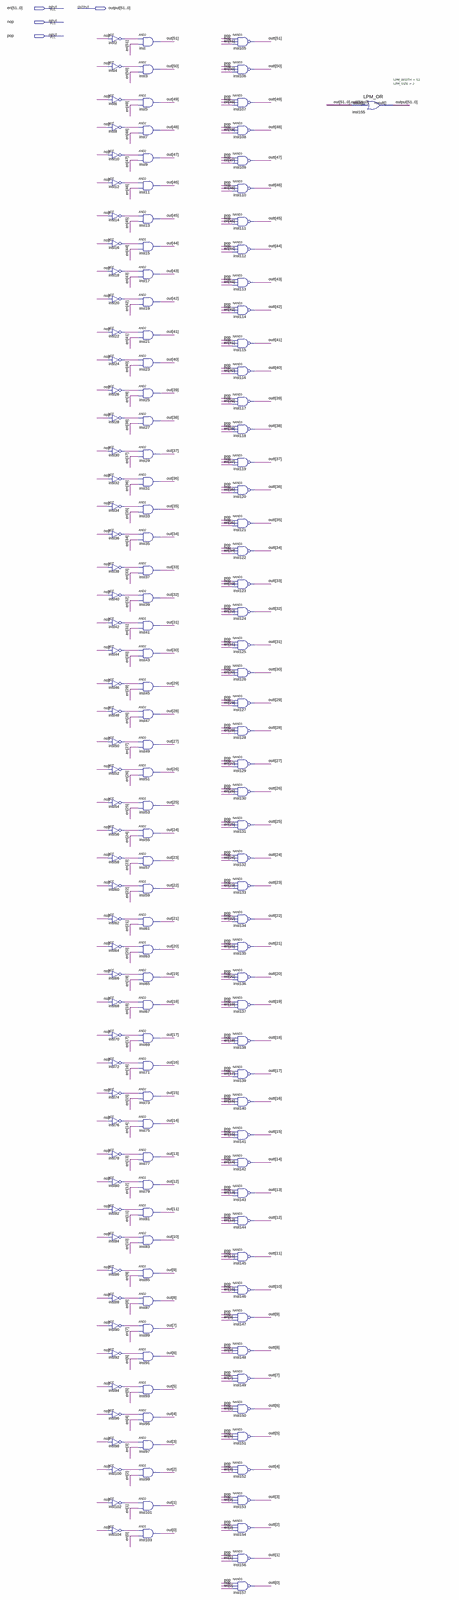
[diagram p0: schematic sheet, whole]
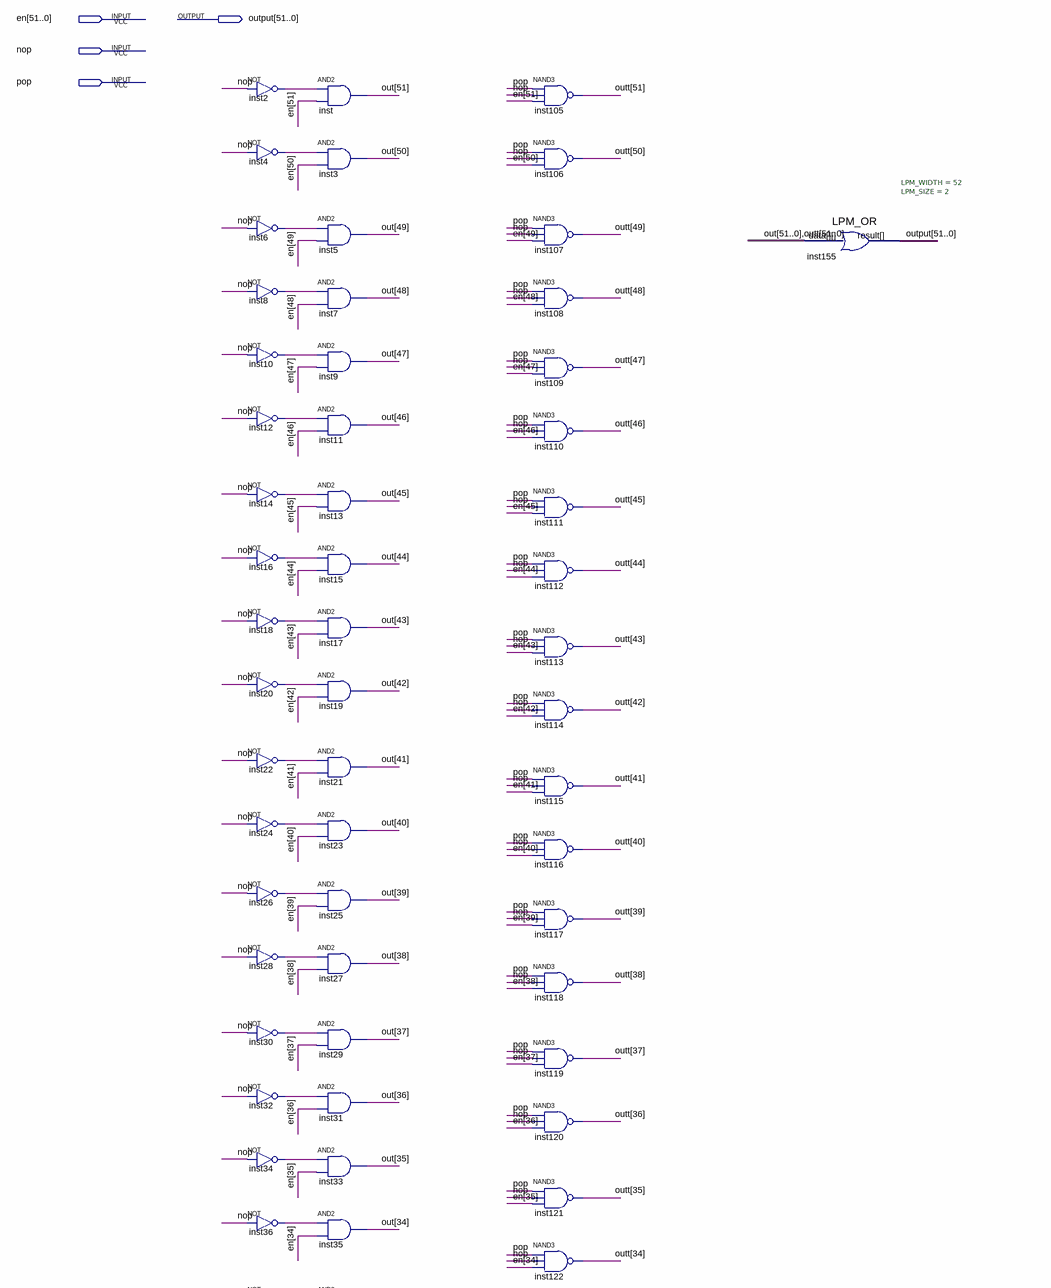
[diagram p1: schematic sheet, upper part]
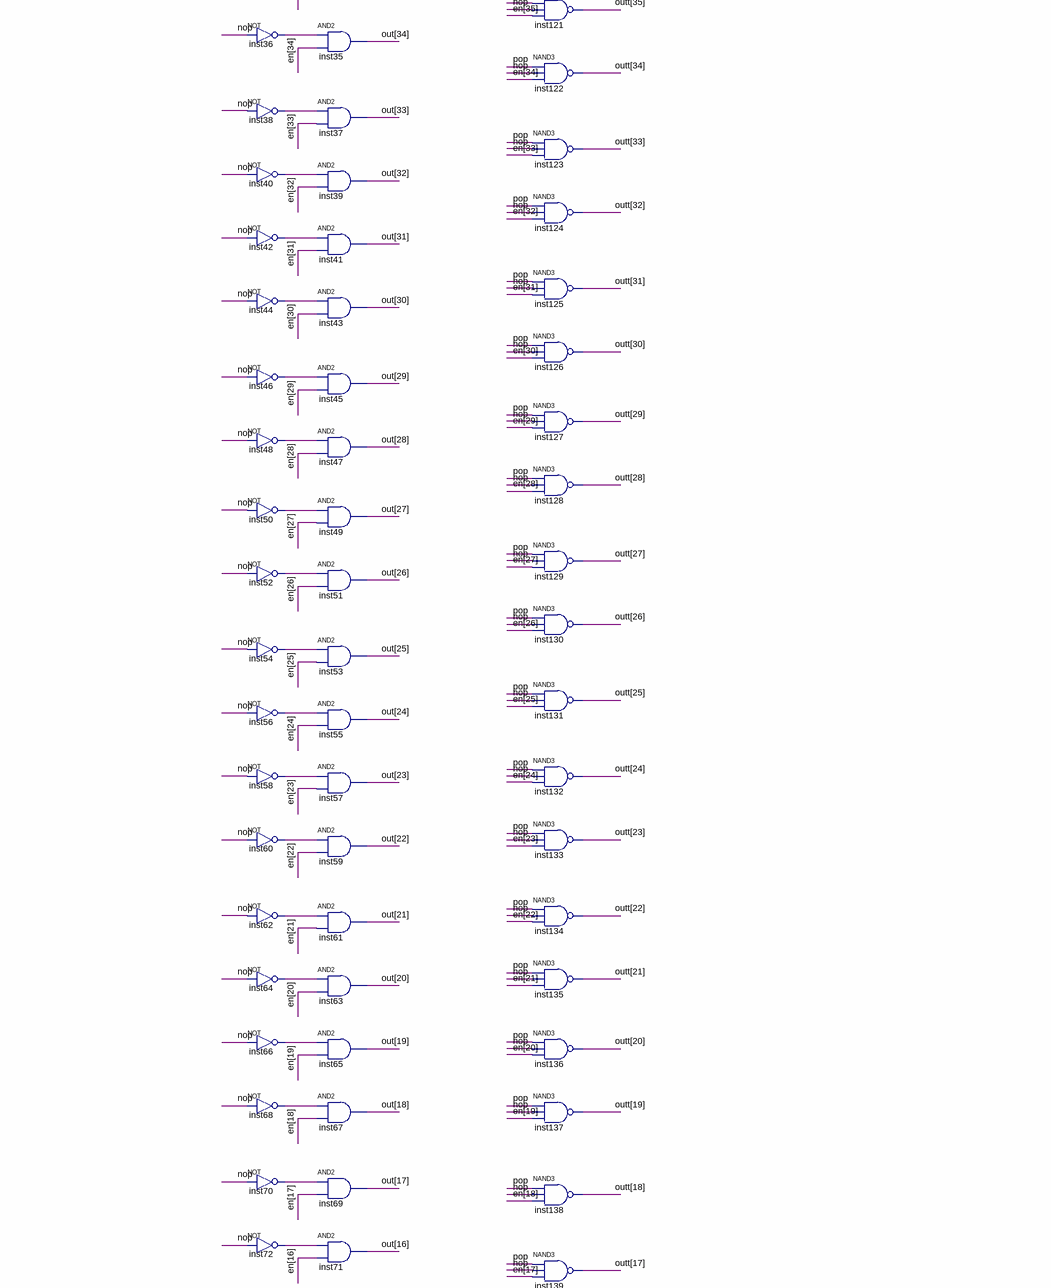
[diagram p2: schematic sheet, middle part]
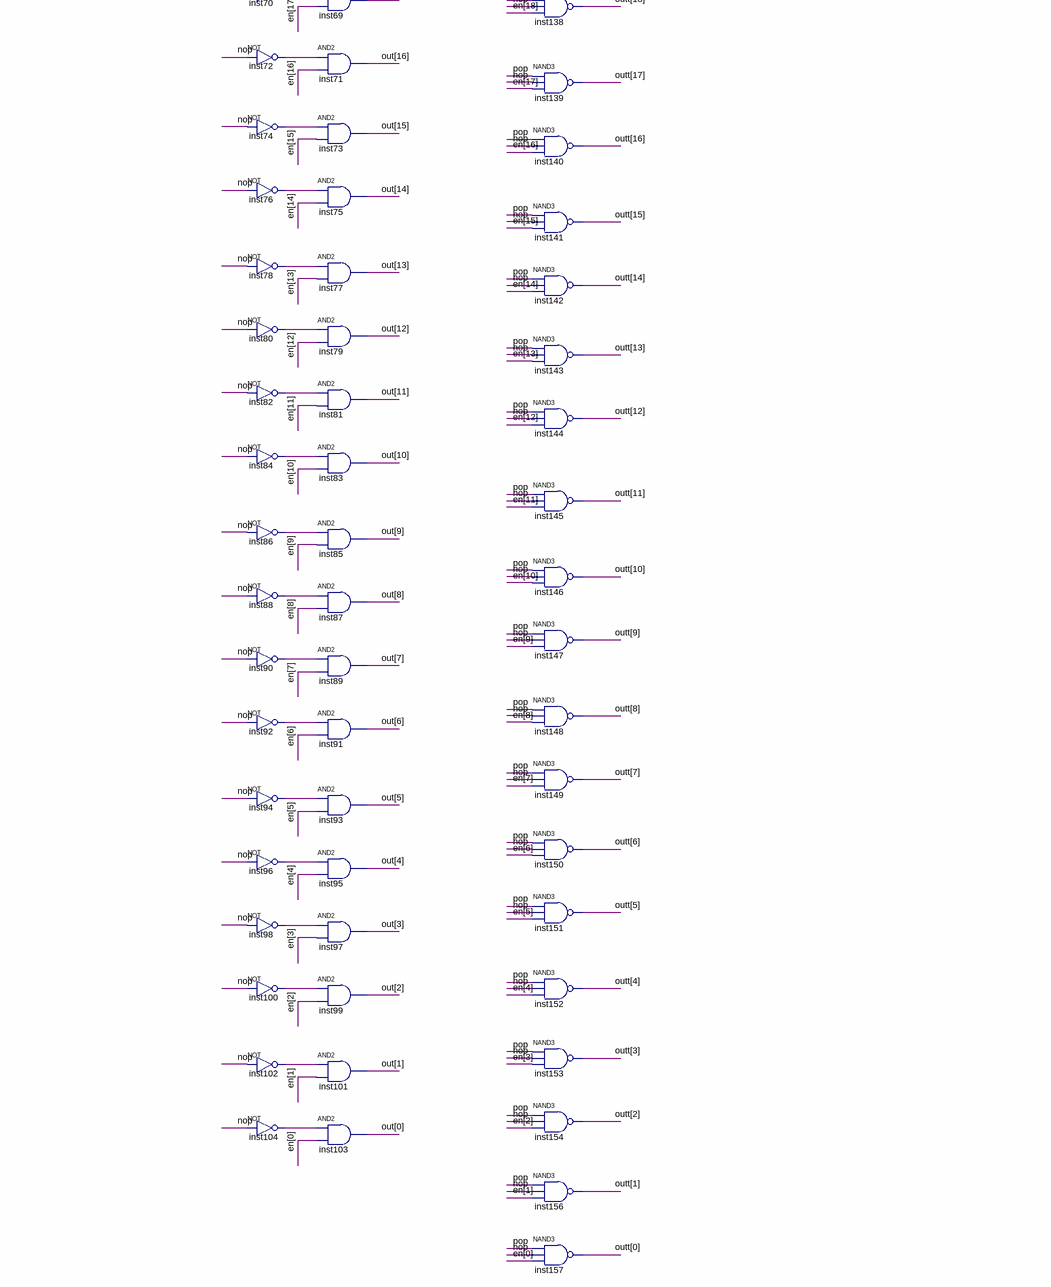
[diagram p3: schematic sheet, lower part]
// Quartus schematic nop_pop_circuit.bdf as structural Verilog: 157 symbols, 4 pins
module nop_pop_circuit (
  input  [51:0] en,
  input  nop,
  input  pop,
  output [51:0] \output 
);

  wire inst2_out, inst4_out, inst6_out, inst8_out, inst10_out, inst12_out, inst14_out, inst16_out,
       inst18_out, inst20_out, inst22_out, inst24_out, inst26_out, inst28_out, inst30_out, inst32_out,
       inst34_out, inst36_out, inst38_out, inst40_out, inst42_out, inst44_out, inst46_out, inst48_out,
       inst50_out, inst52_out, inst54_out, inst56_out, inst58_out, inst60_out, inst62_out, inst64_out,
       inst66_out, inst68_out, inst70_out, inst72_out, inst74_out, inst76_out, inst78_out, inst80_out,
       inst82_out, inst84_out, inst86_out, inst88_out, inst90_out, inst92_out, inst94_out, inst96_out,
       inst98_out, inst100_out, inst102_out, inst104_out;
  wire [51:0] out, outt;

  not inst2 (inst2_out, nop);
  not inst4 (inst4_out, nop);
  not inst6 (inst6_out, nop);
  not inst8 (inst8_out, nop);
  not inst10 (inst10_out, nop);
  not inst12 (inst12_out, nop);
  not inst14 (inst14_out, nop);
  not inst16 (inst16_out, nop);
  not inst18 (inst18_out, nop);
  not inst20 (inst20_out, nop);
  not inst22 (inst22_out, nop);
  not inst24 (inst24_out, nop);
  not inst26 (inst26_out, nop);
  not inst28 (inst28_out, nop);
  not inst30 (inst30_out, nop);
  not inst32 (inst32_out, nop);
  not inst34 (inst34_out, nop);
  not inst36 (inst36_out, nop);
  not inst38 (inst38_out, nop);
  not inst40 (inst40_out, nop);
  not inst42 (inst42_out, nop);
  not inst44 (inst44_out, nop);
  not inst46 (inst46_out, nop);
  not inst48 (inst48_out, nop);
  not inst50 (inst50_out, nop);
  not inst52 (inst52_out, nop);
  not inst54 (inst54_out, nop);
  not inst56 (inst56_out, nop);
  not inst58 (inst58_out, nop);
  not inst60 (inst60_out, nop);
  not inst62 (inst62_out, nop);
  not inst64 (inst64_out, nop);
  not inst66 (inst66_out, nop);
  not inst68 (inst68_out, nop);
  not inst70 (inst70_out, nop);
  not inst72 (inst72_out, nop);
  not inst74 (inst74_out, nop);
  not inst76 (inst76_out, nop);
  not inst78 (inst78_out, nop);
  not inst80 (inst80_out, nop);
  not inst82 (inst82_out, nop);
  not inst84 (inst84_out, nop);
  not inst86 (inst86_out, nop);
  not inst88 (inst88_out, nop);
  not inst90 (inst90_out, nop);
  not inst92 (inst92_out, nop);
  not inst94 (inst94_out, nop);
  not inst96 (inst96_out, nop);
  not inst98 (inst98_out, nop);
  not inst100 (inst100_out, nop);
  not inst102 (inst102_out, nop);
  not inst104 (inst104_out, nop);
  and inst (out[51], inst2_out, en[51]);
  and inst3 (out[50], inst4_out, en[50]);
  and inst5 (out[49], inst6_out, en[49]);
  and inst7 (out[48], inst8_out, en[48]);
  and inst9 (out[47], inst10_out, en[47]);
  and inst11 (out[46], inst12_out, en[46]);
  and inst13 (out[45], inst14_out, en[45]);
  and inst15 (out[44], inst16_out, en[44]);
  and inst17 (out[43], inst18_out, en[43]);
  and inst19 (out[42], inst20_out, en[42]);
  and inst21 (out[41], inst22_out, en[41]);
  and inst23 (out[40], inst24_out, en[40]);
  and inst25 (out[39], inst26_out, en[39]);
  and inst27 (out[38], inst28_out, en[38]);
  and inst29 (out[37], inst30_out, en[37]);
  and inst31 (out[36], inst32_out, en[36]);
  and inst33 (out[35], inst34_out, en[35]);
  and inst35 (out[34], inst36_out, en[34]);
  and inst37 (out[33], inst38_out, en[33]);
  and inst39 (out[32], inst40_out, en[32]);
  and inst41 (out[31], inst42_out, en[31]);
  and inst43 (out[30], inst44_out, en[30]);
  and inst45 (out[29], inst46_out, en[29]);
  and inst47 (out[28], inst48_out, en[28]);
  and inst49 (out[27], inst50_out, en[27]);
  and inst51 (out[26], inst52_out, en[26]);
  and inst53 (out[25], inst54_out, en[25]);
  and inst55 (out[24], inst56_out, en[24]);
  and inst57 (out[23], inst58_out, en[23]);
  and inst59 (out[22], inst60_out, en[22]);
  and inst61 (out[21], inst62_out, en[21]);
  and inst63 (out[20], inst64_out, en[20]);
  and inst65 (out[19], inst66_out, en[19]);
  and inst67 (out[18], inst68_out, en[18]);
  and inst69 (out[17], inst70_out, en[17]);
  and inst71 (out[16], inst72_out, en[16]);
  and inst73 (out[15], inst74_out, en[15]);
  and inst75 (out[14], inst76_out, en[14]);
  and inst77 (out[13], inst78_out, en[13]);
  and inst79 (out[12], inst80_out, en[12]);
  and inst81 (out[11], inst82_out, en[11]);
  and inst83 (out[10], inst84_out, en[10]);
  and inst85 (out[9], inst86_out, en[9]);
  and inst87 (out[8], inst88_out, en[8]);
  and inst89 (out[7], inst90_out, en[7]);
  and inst91 (out[6], inst92_out, en[6]);
  and inst93 (out[5], inst94_out, en[5]);
  and inst95 (out[4], inst96_out, en[4]);
  and inst97 (out[3], inst98_out, en[3]);
  and inst99 (out[2], inst100_out, en[2]);
  and inst101 (out[1], inst102_out, en[1]);
  and inst103 (out[0], inst104_out, en[0]);
  nand inst105 (outt[51], pop, nop, en[51]);
  nand inst106 (outt[50], pop, nop, en[50]);
  nand inst107 (outt[49], pop, nop, en[49]);
  nand inst108 (outt[48], pop, nop, en[48]);
  nand inst109 (outt[47], pop, nop, en[47]);
  nand inst110 (outt[46], pop, nop, en[46]);
  nand inst111 (outt[45], pop, nop, en[45]);
  nand inst112 (outt[44], pop, nop, en[44]);
  nand inst113 (outt[43], pop, nop, en[43]);
  nand inst114 (outt[42], pop, nop, en[42]);
  nand inst115 (outt[41], pop, nop, en[41]);
  nand inst116 (outt[40], pop, nop, en[40]);
  nand inst117 (outt[39], pop, nop, en[39]);
  nand inst118 (outt[38], pop, nop, en[38]);
  nand inst119 (outt[37], pop, nop, en[37]);
  nand inst120 (outt[36], pop, nop, en[36]);
  nand inst121 (outt[35], pop, nop, en[35]);
  nand inst122 (outt[34], pop, nop, en[34]);
  nand inst123 (outt[33], pop, nop, en[33]);
  nand inst124 (outt[32], pop, nop, en[32]);
  nand inst125 (outt[31], pop, nop, en[31]);
  nand inst126 (outt[30], pop, nop, en[30]);
  nand inst127 (outt[29], pop, nop, en[29]);
  nand inst128 (outt[28], pop, nop, en[28]);
  nand inst129 (outt[27], pop, nop, en[27]);
  nand inst130 (outt[26], pop, nop, en[26]);
  nand inst131 (outt[25], pop, nop, en[25]);
  nand inst132 (outt[24], pop, nop, en[24]);
  nand inst133 (outt[23], pop, nop, en[23]);
  nand inst134 (outt[22], pop, nop, en[22]);
  nand inst135 (outt[21], pop, nop, en[21]);
  nand inst136 (outt[20], pop, nop, en[20]);
  nand inst137 (outt[19], pop, nop, en[19]);
  nand inst138 (outt[18], pop, nop, en[18]);
  nand inst139 (outt[17], pop, nop, en[17]);
  nand inst140 (outt[16], pop, nop, en[16]);
  nand inst141 (outt[15], pop, nop, en[15]);
  nand inst142 (outt[14], pop, nop, en[14]);
  nand inst143 (outt[13], pop, nop, en[13]);
  nand inst144 (outt[12], pop, nop, en[12]);
  nand inst145 (outt[11], pop, nop, en[11]);
  nand inst146 (outt[10], pop, nop, en[10]);
  nand inst147 (outt[9], pop, nop, en[9]);
  nand inst148 (outt[8], pop, nop, en[8]);
  nand inst149 (outt[7], pop, nop, en[7]);
  nand inst150 (outt[6], pop, nop, en[6]);
  nand inst151 (outt[5], pop, nop, en[5]);
  nand inst152 (outt[4], pop, nop, en[4]);
  nand inst153 (outt[3], pop, nop, en[3]);
  nand inst154 (outt[2], pop, nop, en[2]);
  nand inst156 (outt[1], pop, nop, en[1]);
  nand inst157 (outt[0], pop, nop, en[0]);
  LPM_OR #(.LPM_WIDTH(52), .LPM_SIZE(2)) inst155 (.data({out, outt}), .result(\output ));
endmodule
